# Altium project walkEEG_pre_amp.PrjPCB
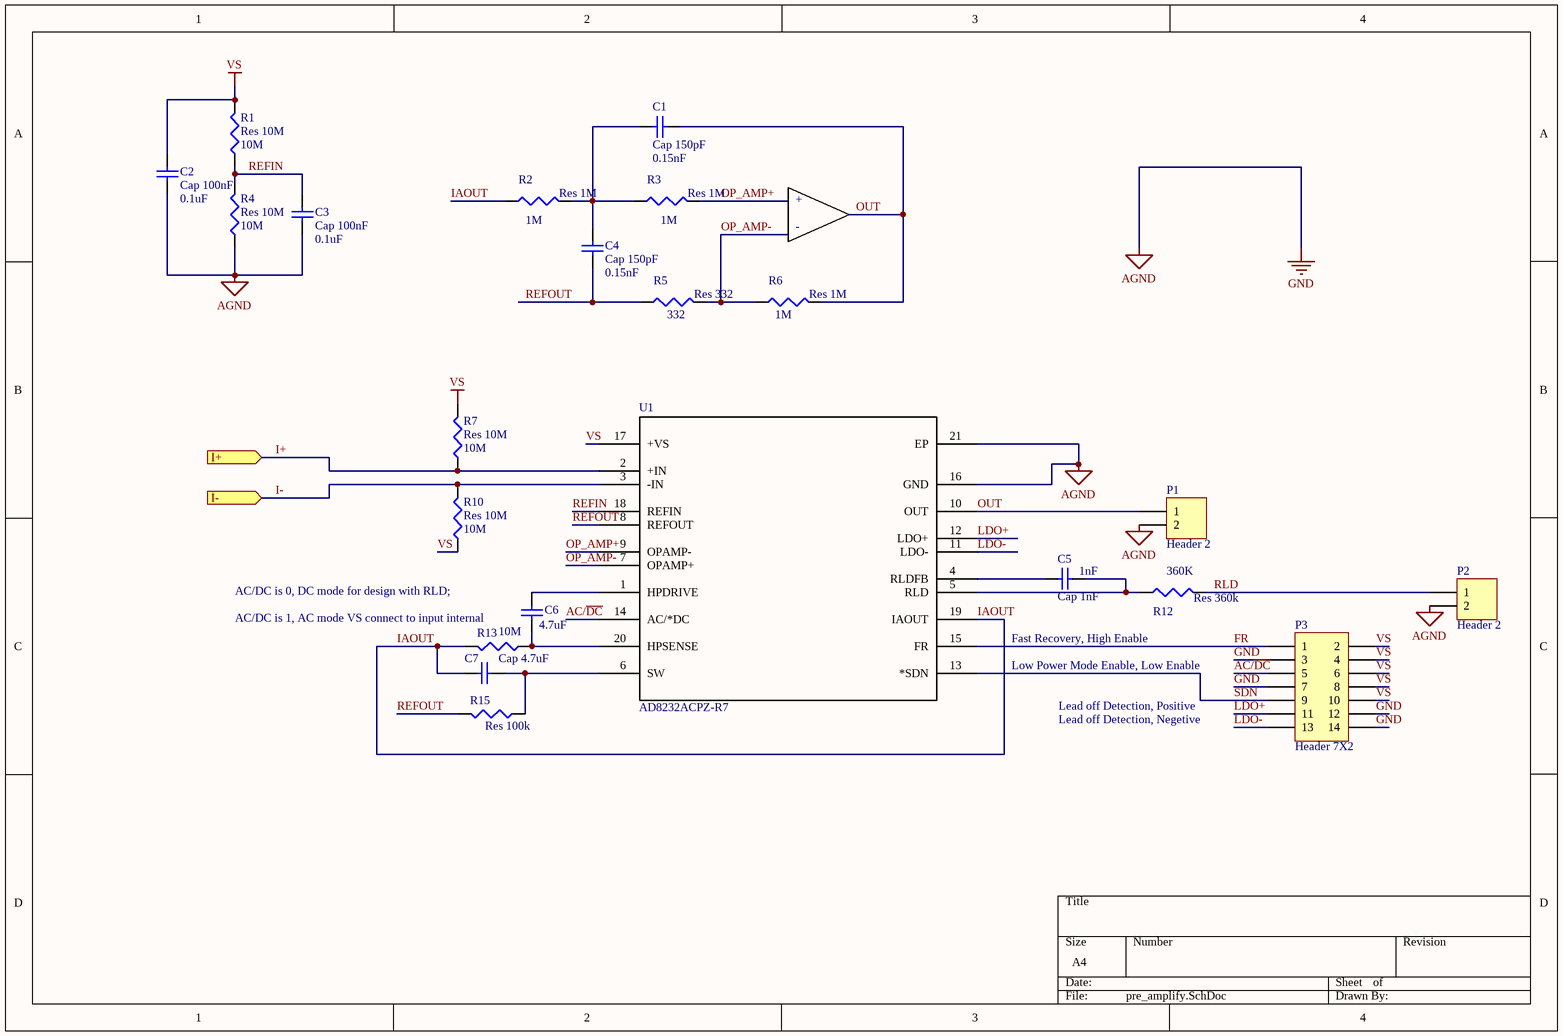
[diagram p0: pre_amplify.SchDoc]
2 sheets, 37 parts. Net scope: flat (ports and power ports of the same name join across sheets).
Board file: pre_amp.PcbDoc
Sheets:
  pre_amplify.SchDoc
  protect.SchDoc

## Sheet pre_amplify.SchDoc
size A4

### Parts
C1  Cap 150pF  value 0.15nF  [0402]
C2  Cap 100nF  value 0.1uF  [0402]
C3  Cap 100nF  value 0.1uF  [0402]
C4  Cap 150pF  value 0.15nF  [0402]
C5  Cap 1nF  value 1nF  [0402]
C6  value 4.7uF  [0402]  (hidden comment: Cap 4.7uF)
C7  Cap 4.7uF  [0402]
P1  Header 2  [HDR1X2]
P2  Header 2  [HDR1X2]
P3  Header 7X2  [HDR2X7]
R1  Res 10M  value 10M  [0402]
R2  Res 1M  value 1M  [0402]
R3  Res 1M  value 1M  [0402]
R4  Res 10M  value 10M  [0402]
R5  Res 332  value 332  [0402]
R6  Res 1M  value 1M  [0402]
R7  Res 10M  value 10M  [0402]
R10  Res 10M  value 10M  [0402]
R12  Res 360k  value 360K  [0402]
R13  value 10M  [0402]  (hidden comment: Res 10M)
R15  Res 100k  [0402]
U1  AD8232ACPZ-R7  [CP_20_10]

### Ports
I+ (in), I- (in)

### Nets
GND: C2.1 C3.1 P1.2 P2.2 P3.3 P3.7 P3.12 P3.14 R4.1 U1.16(GND) U1.21(EP)  [also labelled AGND]
VS: C2.2 P3.2 P3.4 P3.6 P3.8 P3.10 R1.2 R7.2 R10.1 U1.17(+VS)
AC/~{DC}: P3.5 U1.14(AC/*DC)
FR: P3.1 U1.15(FR)
I+: R7.1 U1.2(+IN) ; port I+
I-: R10.2 U1.3(-IN) ; port I-
IAOUT: C7.2 R2.1 R13.2 U1.19(IAOUT)
LDO+: P3.11 U1.12(LDO+)
LDO-: P3.13 U1.11(LDO-)
OP_AMP+: R3.2 U1.9(OPAMP-)
OP_AMP-: R5.2 R6.1 U1.7(OPAMP+)
OUT: C1.1 P1.1 R6.2 U1.10(OUT)
REFIN: C3.2 R1.1 R4.2 U1.18(REFIN)
REFOUT: C4.2 R5.1 R15.2 U1.8(REFOUT)
RLD: P2.1 R12.2
SDN: P3.9 U1.13(*SDN)
NetC1_2: C1.2 C4.1 R2.2 R3.1
NetC5_1: C5.1 R12.1 U1.5(RLD)
NetC5_2: C5.2 U1.4(RLDFB)
NetC6_1: C6.1 R13.1 U1.20(HPSENSE)
NetC6_2: C6.2 U1.1(HPDRIVE)
NetC7_1: C7.1 R15.1 U1.6(SW)

### Notes on the sheet
- +
- -
- AC/DC is 0, DC mode for design with RLD;
- (near C6) AC/DC is 1, AC mode VS connect to input internal
- Fast Recovery, High Enable
- Low Power Mode Enable, Low Enable
- Lead off Detection, Positive
- Lead off Detection, Negetive

### Library data of the parts
C1-C7 = Cap Semi: Capacitor (Semiconductor SIM Model); Published: 8-Jun-2000; LatestRevisionDate: 29-May-2009; LatestRevisionNote: IPC-7351 Footprint Added.; PackageReference: C1206; Publisher: Altium Limited; PackageDescription: Chip Capacitor
P1 P2 = Header 2: Header, 2-Pin; LatestRevisionDate: 17-Jul-2002; LatestRevisionNote: Re-released for DXP Platform.; Publisher: Altium Limited
P3 = Header 7X2: Power, Control and Info Connection; LatestRevisionDate: 17-Jul-2002; LatestRevisionNote: Re-released for DXP Platform.; Publisher: Altium Limited
R1-R7 R10 R12 R13 R15 = Res3: Resistor; Published: 8-Jun-2000; LatestRevisionDate: 29-May-2009; LatestRevisionNote: IPC-7351 Footprint Added.; PackageReference: J1-0603; Publisher: Altium Limited; PackageDescription: Chip Resistor
U1 = AD8232ACPZ-R7: Imported; RefDes: RefDes; Type: DEV; Value: Value

## Sheet protect.SchDoc
size A4
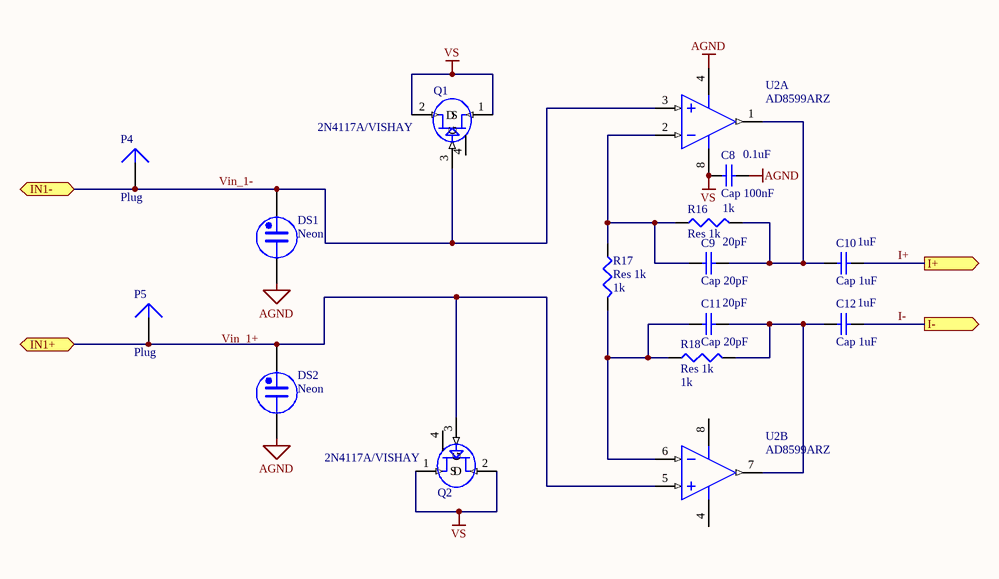
[diagram p1: protect.SchDoc]

### Parts
C8  Cap 100nF  value 0.1uF  [0402]
C9  Cap 20pF  value 20pF  [0402]
C10  Cap 1uF  value 1uF  [0402]
C11  Cap 20pF  value 20pF  [0402]
C12  Cap 1uF  value 1uF  [0402]
DS1  Neon  [PIN2]
DS2  Neon  [PIN2]
P4  Plug  [PIN1]
P5  Plug  [PIN1]
Q1  2N4117A/VISHAY  [TO236]
Q2  2N4117A/VISHAY  [TO236]
R16  Res 1k  value 1k  [0402]
R17  Res 1k  value 1k  [0402]
R18  Res 1k  value 1k  [0402]
U2  AD8599ARZ  [ADI-R-8_N]  (parts A,B of 2)

### Ports
I+ (out), I- (out), IN1+, IN1-

### Nets
AGND: C8.1 DS1.2 DS2.2 U2.4(-V)  [project net GND]
VS: C8.2 Q1.1(S) Q1.2(D) Q2.1(S) Q2.2(D) U2.8(+V)
I+: C10.1 ; port I+
I-: C12.1 ; port I-
Vin_1-: DS1.1 P4.1 Q1.3(G) U2.3(+IN_A) ; port IN1-
NetC9_1: C9.1 C10.2 R16.2 U2.1(OUT_A)
NetC9_2: C9.2 R16.1 R17.1 U2.2(-IN_A)
NetC11_1: C11.1 C12.2 R18.2 U2.7(OUT_B)
NetC11_2: C11.2 R17.2 R18.1 U2.6(-IN_B)
NetDS2_1: DS2.1 P5.1 Q2.3(G) U2.5(+IN_B) ; port IN1+

Not connected (* = marked no-connect by the designer): Q1 4; Q2 4

### Notes on the sheet
- Labels drawn without touching a wire or pin: Vin_1+

### Library data of the parts
C8-C12 = Cap Semi: Capacitor (Semiconductor SIM Model); Published: 8-Jun-2000; LatestRevisionDate: 29-May-2009; LatestRevisionNote: IPC-7351 Footprint Added.; PackageReference: C1206; Publisher: Altium Limited; PackageDescription: Chip Capacitor
DS1 DS2 = Neon: Neon Bulb; Published: 24-Mar-1999; LatestRevisionDate: 17-Jul-2002; LatestRevisionNote: Re-released for DXP Platform.; PackageReference: PIN2; Publisher: Altium Limited
Q1 Q2 = JFET N
R16-R18 = Res3: Resistor; Published: 8-Jun-2000; LatestRevisionDate: 29-May-2009; LatestRevisionNote: IPC-7351 Footprint Added.; PackageReference: J1-0603; Publisher: Altium Limited; PackageDescription: Chip Resistor
U2 = AD8599ARZ: Double Channel Wide Bandwidth Operational Amplifier, 10 MHz BW, 16 V/us SR, Industrial, 8-pin SOIC (R-8), Tube; Generica Part Number: AD8599; Manufacturer: Analog Devices; Amplifiers Per Package: 2; Input Bias Current: 25nA; Input Offset Voltage: 10uV; Iq/Amp: 5.7mA; Slew Rate: 14V/us; Small Signal Bandwidth: 10MHz; V Span Max: 30V; V Span Min: 9V; DatasheetVersion: Rev. C; PackageVersion: 060506-A; PackageReference: R-8; PackageDescription: 8-Pin Standard Small Outline Package, Body 3.9 x 4.9 mm, Pitch 1.27 mm; Supplier 1: Digi-Key; Supplier Part Number 1: AD8599ARZ-ND; Supplier 2: Farnell; Supplier Part Number 2: 1438872; Supplier 3: Newark; Supplier Part Number 3: 34M5072; Mounting Technology: Surface Mount; Code_JEDEC: MS-012-AA; PartNumber: AD8599ARZ; ComponentLink1Description: Manufacturer URL; ComponentLink1URL: http://www.analog.com/en/index.html; ComponentLink2Description: Datasheet; ComponentLink2URL: http://www.analog.com/static/imported-files/data_sheets/AD8597_8599.pdf; ComponentLink3Description: Package Specification; ComponentLink3URL: http://www.analog.com/static/imported-files/packages/PKG_PDF/SOIC_Narrow%20(R)/R_8.pdf; ComponentLink4Description: URL Link1; ComponentLink4URL: Reference Circuit:http://www.analog.com/en/all-operational-amplifiers-op-amps/operational-amplifiers-op-amps/ad8599/products/product.html#product-recommendations
P4 P5 = Plug: LatestRevisionDate: 17-Jul-2002; LatestRevisionNote: Re-released for DXP Platform.; Publisher: Altium Limited

## Nets that join several sheets
GND: pre_amplify (11 pins), protect (C8.1 DS1.2 DS2.2 U2.4)
VS: pre_amplify (10 pins), protect (6 pins)
I+: pre_amplify (R7.1 U1.2), protect (C10.1)
I-: pre_amplify (R10.2 U1.3), protect (C12.1)